# Altium schematic sheet psram.SchDoc
size A
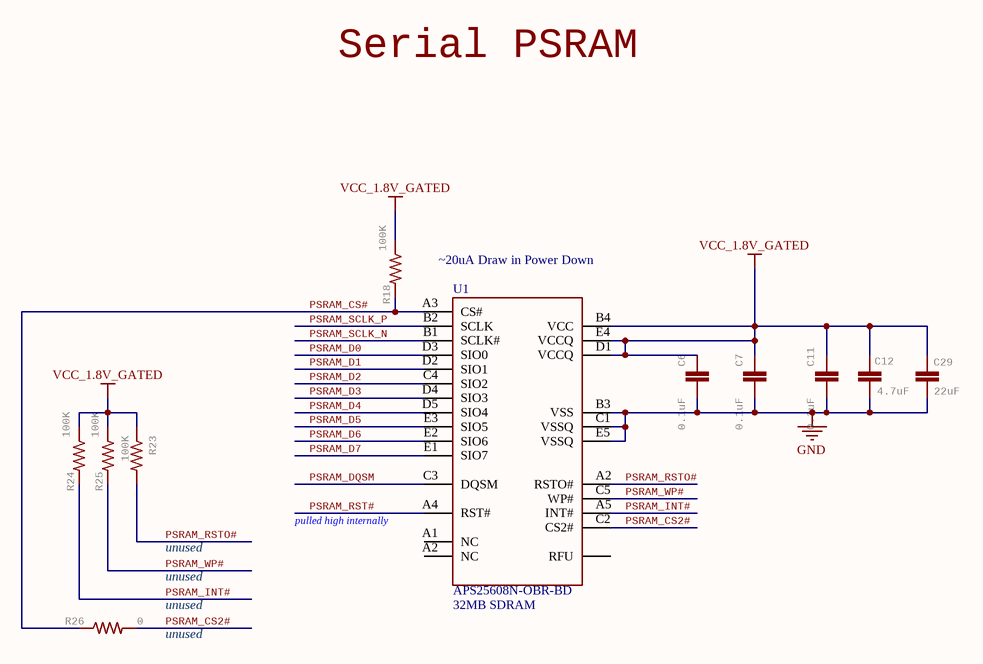
[diagram p0: psram.SchDoc]

## Parts
C6  0.1uF  [0402-CAP]
C7  0.1uF  [0402-CAP]
C11  0.1uF  [0402-CAP]
C12  4.7uF  [0402-CAP]
C29  22uF  [0805]
R18  100K  [0402-RES]
R23  100K  [0402-RES]
R24  100K  [0402-RES]
R25  100K  [0402-RES]
R26  0  [0402-RES]
U1  APS25608N-OBR-BD  [24-TBGA]

## Nets
GND: C6.2 C7.2 C11.2 C12.1 C29.1 U1.B3(VSS) U1.C1(VSSQ) U1.E5(VSSQ)
VCC_1.8V_GATED: C6.1 C7.1 C11.1 C12.2 C29.2 R18.1 R23.1 R24.1 R25.1 U1.B4(VCC) U1.D1(VCCQ) U1.E4(VCCQ)
PSRAM_CS2#: R26.2 U1.C2(CS2#)
PSRAM_CS#: R18.2 R26.1 U1.A3(CS#)
PSRAM_D0: U1.D3(SIO0)
PSRAM_D1: U1.D2(SIO1)
PSRAM_D2: U1.C4(SIO2)
PSRAM_D3: U1.D4(SIO3)
PSRAM_D4: U1.D5(SIO4)
PSRAM_D5: U1.E3(SIO5)
PSRAM_D6: U1.E2(SIO6)
PSRAM_D7: U1.E1(SIO7)
PSRAM_DQSM: U1.C3(DQSM)
PSRAM_INT#: R24.2 U1.A5(INT#)
PSRAM_RST#: U1.A4(RST#)
PSRAM_RSTO#: R23.2 U1.A2(NC)
PSRAM_SCLK_N: U1.B1(SCLK#)
PSRAM_SCLK_P: U1.B2(SCLK)
PSRAM_WP#: R25.2 U1.C5(RFU)

Not connected (* = marked no-connect by the designer): U1 A1(NC)

## Notes on the sheet
- Serial PSRAM
- ~20uA Draw in Power Down
- unused
- (near U1) pulled high internally
- (near R26) unused
- (near U1) 32MB SDRAM

## Library data of the parts
C6 C7 C11 = C-EUC0201: CAPACITOR, European symbol; MPN: C0402C104Z4VAC; GateName_1: G$1; SymbolName_1: C-EU; POPULARITY: 0; LibraryName: rcl; DeviceSetName: C-EU; SPICEPREFIX: C; Part Number: C0402C104Z4VAC
C12 = CAP0402-CAP: CapacitorStandard 0603 ceramic capacitor, and 0.1" leaded capacitor.; MPN: JMK105BBJ475MV-F; GateName_1: G$1; SymbolName_1: CAP; DeviceName: 0402-CAP; LibraryName: sfe; DeviceSetName: CAP; Part Number: JMK105BBJ475MV-F
C29 = 22UF-0805-6.3V-20%: 22ÂµF ceramic capacitors    A capacitor is a passive two-terminal electrical component used to store electrical energy temporarily in an electric field.; MPN: CL21A226MQQNNNE; GateName_1: G$1; SymbolName_1: CAP; PROD_ID: CAP-08402; DeviceName: -0805-6.3V-20%; LibraryName: SparkFun-Capacitors; DeviceSetName: 22UF; Part Number: CL21A226MQQNNNE
R18 R23-R25 = RESISTOR0402-RES: ResistorBasic schematic elements and footprints for 0603, 1206, and PTH resistors.; MPN: AC0402FR-07100KL; GateName_1: G$1; SymbolName_1: RESISTOR; DeviceName: 0402-RES; LibraryName: sfe; DeviceSetName: RESISTOR; Part Number: AC0402FR-07100KL
R26 = RESISTOR0402-RES: ResistorBasic schematic elements and footprints for 0603, 1206, and PTH resistors.; MPN: RC0402JR-070R; GateName_1: G$1; SymbolName_1: RESISTOR; DeviceName: 0402-RES; LibraryName: sfe; DeviceSetName: RESISTOR; Part Number: RC0402JR-070R
U1 = IS66WVO32M8DALL-200BLI-TR: MF: ISSI; MPN: APS25608N-OBR-BD; Part Number: APS25608N-OBR-BD